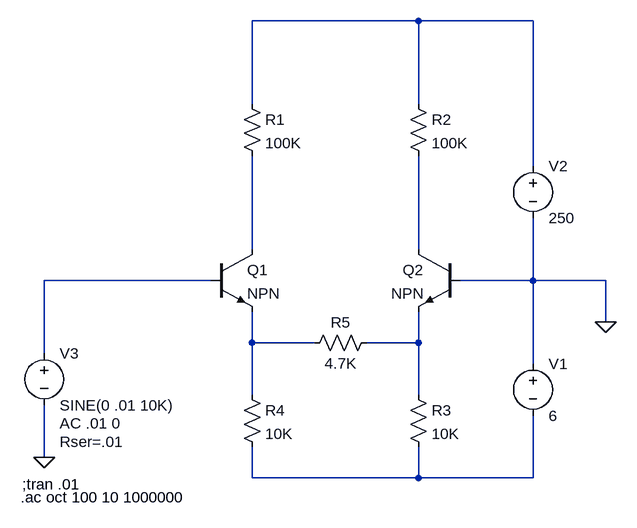
[diagram p0: schematic Draft2.asc]
Draft2.asc, the LTspice schematic file:
Version 4
SHEET 1 880 680
WIRE 416 -224 160 -224
WIRE 592 -224 416 -224
WIRE 160 -96 160 -224
WIRE 416 -96 416 -224
WIRE 592 0 592 -224
WIRE 160 128 160 -16
WIRE 416 128 416 -16
WIRE 96 176 -160 176
WIRE 592 176 592 80
WIRE 592 176 480 176
WIRE 704 176 592 176
WIRE 704 240 704 176
WIRE 160 272 160 224
WIRE 256 272 160 272
WIRE 416 272 416 224
WIRE 416 272 336 272
WIRE -160 288 -160 176
WIRE 592 304 592 176
WIRE 160 352 160 272
WIRE 416 352 416 272
WIRE -160 448 -160 368
WIRE 160 480 160 432
WIRE 416 480 416 432
WIRE 416 480 160 480
WIRE 592 480 592 384
WIRE 592 480 416 480
FLAG 704 240 0
FLAG -160 448 0
SYMBOL res 144 -112 R0
SYMATTR InstName R1
SYMATTR Value 100K
SYMBOL res 400 -112 R0
SYMATTR InstName R2
SYMATTR Value 100K
SYMBOL res 400 336 R0
SYMATTR InstName R3
SYMATTR Value 10K
SYMBOL res 144 336 R0
SYMATTR InstName R4
SYMATTR Value 10K
SYMBOL res 352 256 R90
WINDOW 0 0 56 VBottom 2
WINDOW 3 32 56 VTop 2
SYMATTR InstName R5
SYMATTR Value 4.7K
SYMBOL npn 96 128 R0
SYMATTR InstName Q1
SYMBOL npn 480 128 M0
SYMATTR InstName Q2
SYMBOL voltage 592 288 R0
WINDOW 123 0 0 Left 2
WINDOW 39 0 0 Left 2
SYMATTR InstName V1
SYMATTR Value 6
SYMBOL voltage 592 -16 R0
WINDOW 123 0 0 Left 2
WINDOW 39 0 0 Left 2
SYMATTR InstName V2
SYMATTR Value 250
SYMBOL voltage -160 272 R0
WINDOW 123 24 124 Left 2
WINDOW 39 24 152 Left 2
SYMATTR InstName V3
SYMATTR Value SINE(0 .01 10K)
SYMATTR Value2 AC .01 0
SYMATTR SpiceLine Rser=.01
TEXT -194 490 Left 2 !;tran .01
TEXT -196 510 Left 2 !.ac oct 100 10 1000000

The netlist it stands for:
* Draft2.asc
R1 N001 N002 100K
R2 N001 N003 100K
R3 N006 N007 10K
R4 N005 N007 10K
R5 N006 N005 4.7K
Q1 N002 N004 N005 0 NPN
Q2 N003 0 N006 0 NPN
V1 0 N007 6
V2 N001 0 250
V3 N004 0 SINE(0 .01 10K) AC .01 0 Rser=.01
.model NPN NPN
.model PNP PNP
.lib standard.bjt
;tran .01
.ac oct 100 10 1000000
.backanno
.end